# Altium schematic sheet biv2-LRcom_1a.SchDoc
size 420 x 297 mm; Address1: Address1; Address2: Address2; Address3: Address3; Address4: Address4; DocumentNumber: АБВГ.123456.001 Э3; SheetNumber: 1; Scale: 1:1; DocumentType: Схема электрическая принципиальная; FirstReferrence: АБВГ.123456.001
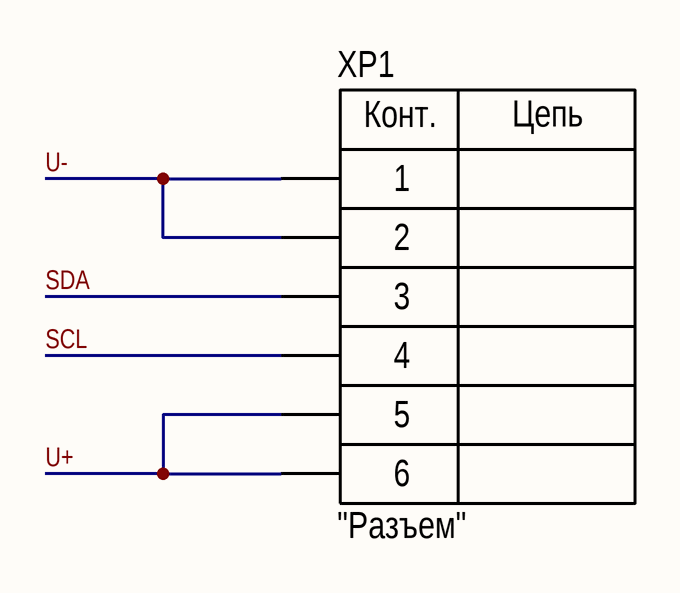
[diagram p0: biv2-LRcom_1a.SchDoc]

## Parts
XP1  CommentText: "Разъем"  [CON: IDC-6MS]

## Nets
SCL: XP1.4
SDA: XP1.3
U+: XP1.5 XP1.6
U-: XP1.1 XP1.2

## Notes on the sheet
- Перв. примен.
- Справ. №
- Подп. и дата
- Инв. № дубл.
- Взам. инв. №
- Разраб.
- Изм.
- Лист
- № докум.
- Подп.
- Дата
- Лит.
- Масса
- Масштаб
- Пров.
- Т.контр.
- Листов
- Инв. № подл.
- Утв.
- Н.контр.
- 2.106-A3
- Копировал
- Формат А3
- (in symbol IDC-6) Конт.; Цепь

## Library data of the parts
XP1 = IDC-6: Manufacturer: Connfly; ValueManufacturerPartNumber: Connector, 6pin, 2.54mm, 250VAC, 3A; TypeConnector: Connector; VoltageMax: 250VAC; Pitch: 2.54mm; CurrentMax: 3A; Multichannel: 6pin; HelpURL: https://ru.aliexpress.com/item/1719644716.html?spm=a2g0v.search0104.3.23.4d9c1bc6xlIt6Q&ws_ab_test=searchweb0_0%2Csearchweb201602_10_10065_10068_319_317_10696_453_10084_454_10083_10618_10307_10301_537_536_10059_10884_10887_321_322_10915_10103_10914_10911_10910%2Csearchweb201603_52%2CppcSwitch_0&algo_expid=18a75006-9775-490c-9b34-8e5eba9edd8d-3&algo_pvid=18a75006-9775-490c-9b34-8e5eba9edd8d&transAbTest=ae803_5; PartNumber: IDC-6